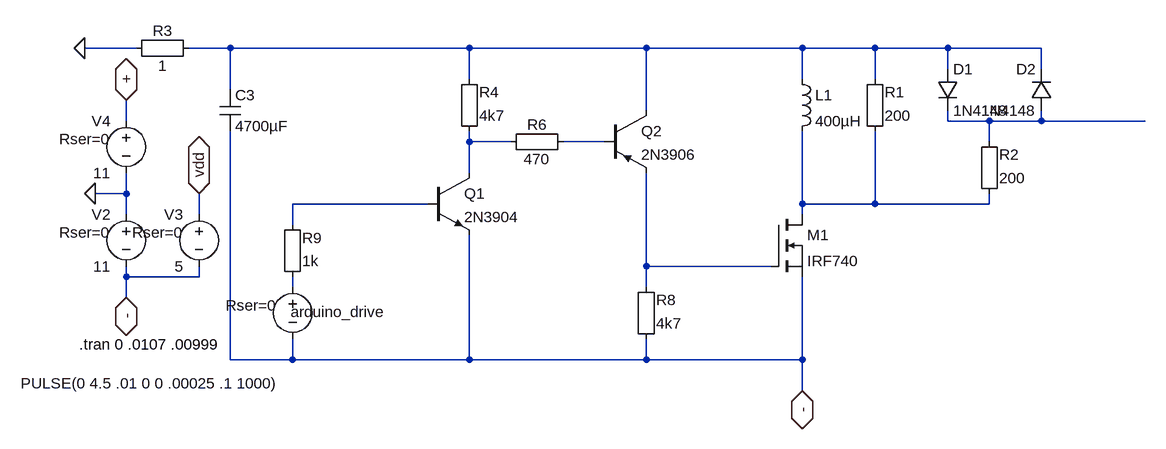
[diagram p0: schematic meat_haw_100.asc]
meat_haw_100.asc, the LTspice schematic file:
Version 4
SHEET 1 4676 1612
WIRE -112 -2400 -192 -2400
WIRE 32 -2400 -32 -2400
WIRE 400 -2400 32 -2400
WIRE 672 -2400 400 -2400
WIRE 912 -2400 672 -2400
WIRE 1024 -2400 912 -2400
WIRE 1136 -2400 1024 -2400
WIRE 1280 -2400 1136 -2400
WIRE 1136 -2368 1136 -2400
WIRE 1280 -2368 1280 -2400
WIRE 400 -2352 400 -2400
WIRE 912 -2352 912 -2400
WIRE 1024 -2352 1024 -2400
WIRE 32 -2336 32 -2400
WIRE 672 -2304 672 -2400
WIRE -128 -2288 -128 -2320
WIRE 1136 -2288 1136 -2304
WIRE 1200 -2288 1136 -2288
WIRE 1280 -2288 1280 -2304
WIRE 1280 -2288 1200 -2288
WIRE 1440 -2288 1280 -2288
WIRE 400 -2256 400 -2272
WIRE 464 -2256 400 -2256
WIRE 608 -2256 544 -2256
WIRE 1200 -2256 1200 -2288
WIRE 400 -2208 400 -2256
WIRE -128 -2176 -128 -2208
WIRE -128 -2176 -176 -2176
WIRE 336 -2160 128 -2160
WIRE 912 -2160 912 -2272
WIRE 1024 -2160 1024 -2272
WIRE 1024 -2160 912 -2160
WIRE 1200 -2160 1200 -2176
WIRE 1200 -2160 1024 -2160
WIRE -128 -2144 -128 -2176
WIRE -16 -2144 -16 -2176
WIRE 912 -2144 912 -2160
WIRE 128 -2128 128 -2160
WIRE 672 -2064 672 -2208
WIRE 864 -2064 672 -2064
WIRE -128 -2048 -128 -2064
WIRE -16 -2048 -16 -2064
WIRE -16 -2048 -128 -2048
WIRE 128 -2032 128 -2048
WIRE 672 -2032 672 -2064
WIRE -128 -2016 -128 -2048
WIRE 32 -1920 32 -2272
WIRE 128 -1920 128 -1952
WIRE 128 -1920 32 -1920
WIRE 400 -1920 400 -2112
WIRE 400 -1920 128 -1920
WIRE 672 -1920 672 -1952
WIRE 672 -1920 400 -1920
WIRE 912 -1920 912 -2048
WIRE 912 -1920 672 -1920
WIRE 912 -1872 912 -1920
FLAG 912 -1872 -
IOPIN 912 -1872 BiDir
FLAG -128 -2016 -
IOPIN -128 -2016 BiDir
FLAG -128 -2320 +
IOPIN -128 -2320 BiDir
FLAG -176 -2176 0
FLAG -192 -2400 0
FLAG -16 -2176 vdd
IOPIN -16 -2176 BiDir
SYMBOL Misc\\EuropeanCap 16 -2336 R0
SYMATTR InstName C3
SYMATTR Value 4700µF
SYMATTR SpiceLine V=400 Irms=1 Rser=.32 Lser=0
SYMBOL ind 896 -2368 R0
SYMATTR InstName L1
SYMATTR Value 400µH
SYMBOL Misc\\EuropeanResistor 1008 -2256 M180
WINDOW 0 31 76 Left 2
WINDOW 3 31 40 Left 2
SYMATTR InstName R1
SYMATTR Value 200
SYMBOL Misc\\EuropeanResistor 1184 -2160 M180
WINDOW 0 31 76 Left 2
WINDOW 3 31 40 Left 2
SYMATTR InstName R2
SYMATTR Value 200
SYMBOL diode 1120 -2368 R0
SYMATTR InstName D1
SYMATTR Value 1N4148
SYMBOL diode 1296 -2304 R180
WINDOW 0 24 64 Left 2
WINDOW 3 24 0 Left 2
SYMATTR InstName D2
SYMATTR Value 1N4148
SYMBOL Misc\\EuropeanResistor -128 -2416 M90
WINDOW 0 5 56 VBottom 2
WINDOW 3 27 56 VTop 2
SYMATTR InstName R3
SYMATTR Value 1
SYMBOL nmos 864 -2144 R0
SYMATTR InstName M1
SYMATTR Value IRF740
SYMBOL voltage 128 -2048 M0
WINDOW 123 0 0 Left 2
WINDOW 39 24 44 Left 2
WINDOW 0 -144 54 Left 2
WINDOW 3 20 164 Left 2
SYMATTR SpiceLine Rser=0
SYMATTR InstName arduino_drive
SYMATTR Value PULSE(0 4.5 .01 0 0 .00025 .1 1000)
SYMBOL voltage -128 -2160 M0
WINDOW 123 0 0 Left 2
WINDOW 39 24 44 Left 2
SYMATTR SpiceLine Rser=0
SYMATTR InstName V2
SYMATTR Value 11
SYMBOL voltage -128 -2304 M0
WINDOW 123 0 0 Left 2
WINDOW 39 24 44 Left 2
SYMATTR SpiceLine Rser=0
SYMATTR InstName V4
SYMATTR Value 11
SYMBOL voltage -16 -2160 M0
WINDOW 123 0 0 Left 2
WINDOW 39 24 44 Left 2
SYMATTR SpiceLine Rser=0
SYMATTR InstName V3
SYMATTR Value 5
SYMBOL npn3 336 -2208 R0
SYMATTR InstName Q1
SYMATTR Value 2N3904
SYMBOL Misc\\EuropeanResistor 384 -2256 M180
WINDOW 0 31 76 Left 2
WINDOW 3 31 40 Left 2
SYMATTR InstName R4
SYMATTR Value 4k7
SYMBOL pnp2 608 -2304 R0
SYMATTR InstName Q2
SYMATTR Value 2N3906
SYMBOL Misc\\EuropeanResistor 656 -1936 M180
WINDOW 0 31 76 Left 2
WINDOW 3 31 40 Left 2
SYMATTR InstName R8
SYMATTR Value 4k7
SYMBOL Misc\\EuropeanResistor 112 -2032 M180
WINDOW 0 31 76 Left 2
WINDOW 3 31 40 Left 2
SYMATTR InstName R9
SYMATTR Value 1k
SYMBOL Misc\\EuropeanResistor 448 -2272 M90
WINDOW 0 5 56 VBottom 2
WINDOW 3 27 56 VTop 2
SYMATTR InstName R6
SYMATTR Value 470
TEXT -200 -1944 Left 2 !.tran 0 .0107 .00999

The netlist it stands for:
* meat_haw_100.asc
C3 N001 - 4700µF V=400 Irms=1 Rser=.32 Lser=0
L1 N001 N006 400µH
R1 N006 N001 200
R2 N006 N002 200
D1 N001 N002 1N4148
D2 N002 N001 1N4148
R3 0 N001 1
M1 N006 N007 - - IRF740
V§arduino_drive N008 - PULSE(0 4.5 .01 0 0 .00025 .1 1000) Rser=0
V2 0 - 11 Rser=0
V4 + 0 11 Rser=0
V3 vdd - 5 Rser=0
Q1 N003 N005 - 0 2N3904
R4 N003 N001 4k7
Q2 N001 N004 N007 0 2N3906
R8 - N007 4k7
R9 N008 N005 1k
R6 N003 N004 470
.model D D
.lib standard.dio
.model NPN NPN
.model PNP PNP
.lib standard.bjt
.model NMOS NMOS
.model PMOS PMOS
.lib standard.mos
.tran 0 .0107 .00999
.backanno
.end